# Altium schematic sheet [8]Sensors.SchDoc
size A4
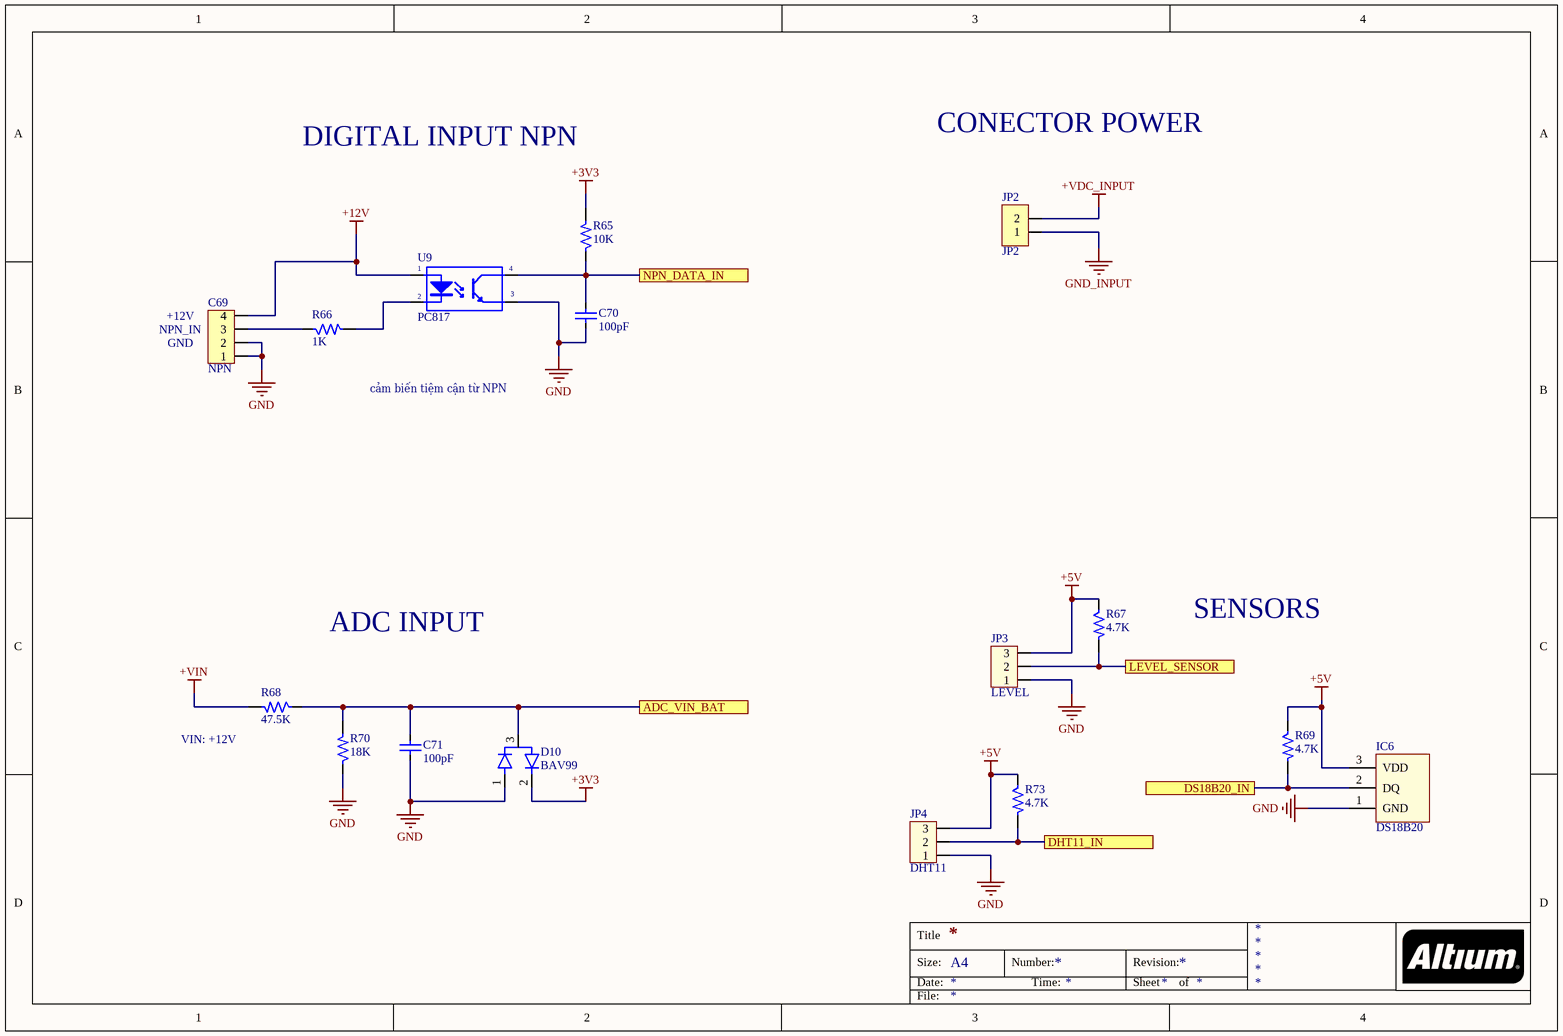
[diagram p0: [8]Sensors.SchDoc]

## Parts
C69  NPN  [CON_4P]
C70  100pF  [CAP_0805]
C71  100pF  [CAP_0805]
D10  BAV99  [DIO_BAV99]
IC6  DS18B20  [DS18S20]
JP2  JP2  [JP2-C1T]
JP3  LEVEL  [CON3]
JP4  DHT11  [CON3]
R65  10K  [R0805]
R66  1K  [R0805]
R67  4.7K  [R0805]
R68  47.5K  [R0805]
R69  4.7K  [R0805]
R70  18K  [R0805]
R73  4.7K  [R0805]
U9  PC817  [SOT254P975X400-4N]

## Ports
ADC_VIN_BAT, DHT11_IN, DS18B20_IN, LEVEL_SENSOR, NPN_DATA_IN

## Nets
+3V3: D10.2 R65.2
+5V: IC6.3(VDD) JP3.3 JP4.3 R67.1 R69.1 R73.1
+12V: C69.4 U9.1(A)
+VDC_INPUT: JP2.2
+VIN: R68.2
GND: C69.1 C69.2 C70.2 C71.2 D10.1 IC6.1(GND) JP3.1 JP4.1 R70.1 U9.3(E)
GND_INPUT: JP2.1
ADC_VIN_BAT: C71.1 D10.3 R68.1 R70.2 ; port ADC_VIN_BAT
DHT11_IN: JP4.2 R73.2 ; port DHT11_IN
DS18B20_IN: IC6.2(DQ) R69.2 ; port DS18B20_IN
LEVEL_SENSOR: JP3.2 R67.2 ; port LEVEL_SENSOR
NPN_DATA_IN: C70.1 R65.1 U9.4(C) ; port NPN_DATA_IN
NetC69_3: C69.3 R66.1
NetR66_2: R66.2 U9.2(K)

## Notes on the sheet
- DIGITAL INPUT NPN
- CONECTOR POWER
- (near C69) +12V
- (near C69) NPN_IN
- (near C69) GND
- cảm biến tiệm cận từ NPN
- ADC INPUT
- SENSORS
- (near R68) VIN: +12V
- Title
- Size:
- Date:
- A4
- Number:
- Time:
- Revision:
- Sheet
- of
- File:

## Library data of the parts
C69 = Header4: Header IDC, 4 x 1 Pin Vertical 2.54mm Pitch (Non-Boxed, Male); Manufacturer: W¨¹rth Elektronik eiSos GmbH; partNo: 613002143121; ComponentLink1 Description: Manufacturer; ComponentLink2 Description: Datasheet; NoPins: 02; Created Date: 29 March 2013; ComponentLink1URL: http://www.we-online.com; ComponentLink2URL: http://katalog.we-online.de/em/datasheet/6130xx143121.pdf; Created by: Karrer Zheng
C70 C71 = CapSMD: Capacitor; Value: 33p; Published: 8-Jun-2000; LatestRevisionDate: 17-Jul-2002; LatestRevisionNote: Re-released for DXP Platform.; PackageReference: RAD-0.3; Publisher: Altium Limited
D10 = BAV99: Diode Array 1 Pair Series Connection Standard 100V 215mA (DC) Surface Mount TO-236-3, SC-59, SOT-23-3; MF: ON Semiconductor; Price: None; Availability: In Stock; MP: BAV99; Package: SOT-23-3 Motorola; SnapEDA_Link: https://www.snapeda.com/parts/BAV99/Onsemi/view-part/?ref=snap; Check_prices: https://www.snapeda.com/parts/BAV99/Onsemi/view-part/?ref=eda; Value: *; Purchase-URL: https://pricing.snapeda.com/search/part/BAV99/?ref=eda
IC6 = DS18S20: High Precision  1-Wire® Digital Thermometer; pin to pad: 1>5 2>4
JP2 = JP2: WR-PHD 2.54 mm Angled Socket Header; Manufacturer: W¨¹rth Elektronik eiSos GmbH; partNo: 613002143121; ComponentLink1 Description: Manufacturer; ComponentLink2 Description: Datasheet; NoPins: 02; Created Date: 29 March 2013; ComponentLink1URL: http://www.we-online.com; ComponentLink2URL: http://katalog.we-online.de/em/datasheet/6130xx143121.pdf; Created by: Karrer Zheng
JP3 JP4 = Con3: Connector 3; Value: Connector 3
R65 R67-R70 R73 = RM: Resistor SMD; Value: 1K
R66 = RM: Resistor SMD; Value: 1K
U9 = PC817: Single Opto; Value: PC817